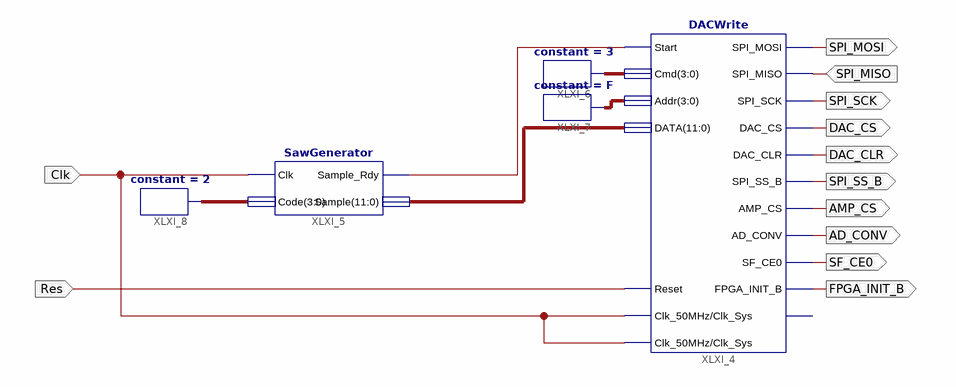
[diagram p0: schematic sheet 1]
// Xilinx ISE schematic schema.sch (spartan3e) as structural Verilog: 5 symbols, 12 ports
module schema (
  input  SPI_MISO,
  input  Clk,
  input  Res,
  output SPI_MOSI,
  output SPI_SCK,
  output DAC_CS,
  output DAC_CLR,
  output SPI_SS_B,
  output AMP_CS,
  output AD_CONV,
  output SF_CE0,
  output FPGA_INIT_B
);

  wire XLXN_8;
  wire [3:0] XLXN_3, XLXN_4, XLXN_6;
  wire [11:0] XLXN_9;

  DACWrite XLXI_4 (
    .Reset(Res), .Start(XLXN_8), .SPI_MISO(SPI_MISO), .Cmd(XLXN_3), .Addr(XLXN_4), .DATA(XLXN_9),
    .DAC_CLR(DAC_CLR), .DAC_CS(DAC_CS), .SPI_MOSI(SPI_MOSI), .SPI_SCK(SPI_SCK), .SPI_SS_B(SPI_SS_B),
    .AMP_CS(AMP_CS), .AD_CONV(AD_CONV), .SF_CE0(SF_CE0), .FPGA_INIT_B(FPGA_INIT_B), .Clk_50MHz(Clk),
    .Clk_Sys(Clk));  // open: Busy
  SawGenerator XLXI_5 (.Clk(Clk), .Code(XLXN_6), .Sample_Rdy(XLXN_8), .Sample(XLXN_9));
  constant #(.CValue("3")) XLXI_6 (.O(XLXN_3));
  constant #(.CValue("F")) XLXI_7 (.O(XLXN_4));
  constant #(.CValue("2")) XLXI_8 (.O(XLXN_6));
endmodule
